# Altium schematic sheet gsm2.SchDoc
size A4
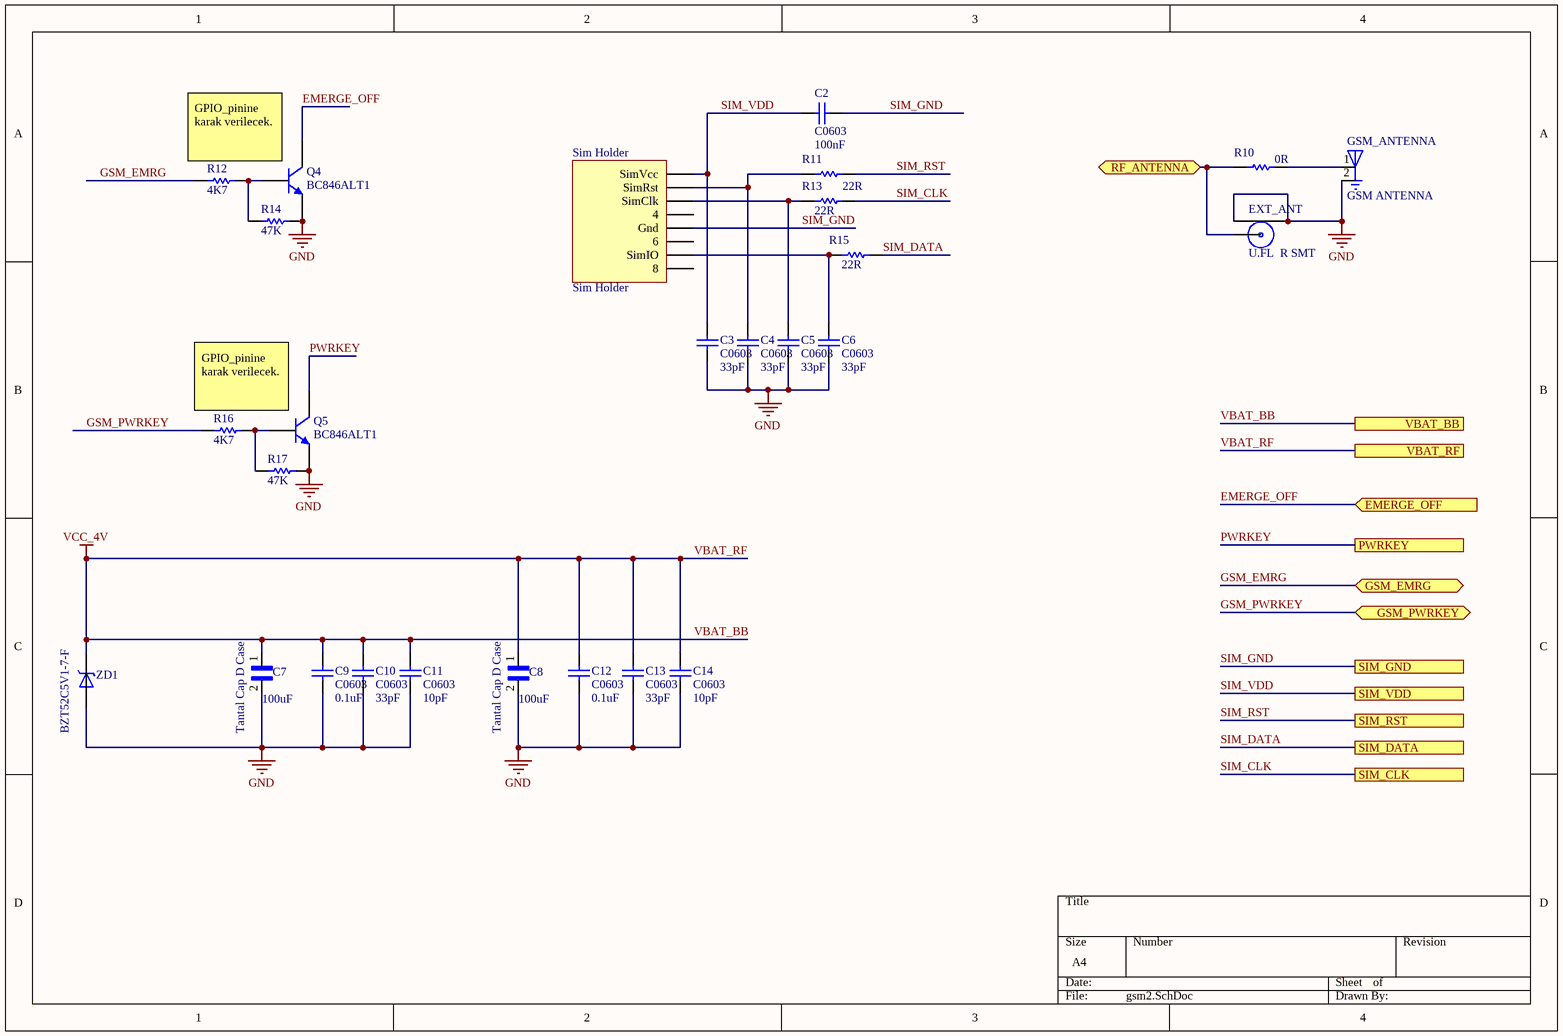
[diagram p0: gsm2.SchDoc]

## Parts
C2  C0603  value 100nF  [C0603]
C3  C0603  value 33pF  [C0603]
C4  C0603  value 33pF  [C0603]
C5  C0603  value 33pF  [C0603]
C6  C0603  value 33pF  [C0603]
C7  Tantal Cap D Case  value 100uF  [Tantal Cap D Case]
C8  Tantal Cap D Case  value 100uF  [Tantal Cap D Case]
C9  C0603  value 0.1uF  [C0603]
C10  C0603  value 33pF  [C0603]
C11  C0603  value 10pF  [C0603]
C12  C0603  value 0.1uF  [C0603]
C13  C0603  value 33pF  [C0603]
C14  C0603  value 10pF  [C0603]
EXT_ANT  U.FL  R SMT  [U.FL  R SMT]
GSM_ANTENNA  GSM ANTENNA  [GSM ANTENNA]
Q4  BC846ALT1  [BC846]
Q5  BC846ALT1  [BC846]
R10  value 0R  [CC1608-0603]  (hidden comment: Res0603)
R11  value 22R  [CC1608-0603]  (hidden comment: Res0603)
R12  value 4K7  [CC1608-0603]  (hidden comment: Res0603)
R13  value 22R  [CC1608-0603]  (hidden comment: Res0603)
R14  value 47K  [CC1608-0603]  (hidden comment: Res0603)
R15  value 22R  [CC1608-0603]  (hidden comment: Res0603)
R16  value 4K7  [CC1608-0603]  (hidden comment: Res0603)
R17  value 47K  [CC1608-0603]  (hidden comment: Res0603)
Sim_Holder  Sim Holder  [SIM HOLDER]
ZD1  BZT52C5V1-7-F  [BZT52C5V1]

## Ports
EMERGE_OFF (in), GSM_EMRG (bidir), GSM_PWRKEY (bidir), PWRKEY, RF_ANTENNA (bidir), SIM_CLK, SIM_DATA, SIM_GND, SIM_RST, SIM_VDD, VBAT_BB, VBAT_RF

## Nets
GND: C3.1 C4.1 C5.1 C6.1 C7.2 C8.2 C9.1 C10.1 C11.1 C12.1 C13.1 C14.1 EXT_ANT.P$2 EXT_ANT.P$3 GSM_ANTENNA.2(GND) Q4.2(E) Q5.2(E) R14.2 R17.2 ZD1.A
VBAT_BB: C7.1 C8.1 C9.2 C10.2 C11.2 C12.2 C13.2 C14.2 ZD1.C ; port VBAT_BB, port VBAT_RF  [also labelled VBAT_RF, VCC_4V]
EMERGE_OFF: Q4.3(C) ; port EMERGE_OFF
GSM_EMRG: R12.1 ; port GSM_EMRG
GSM_PWRKEY: R16.1 ; port GSM_PWRKEY
PWRKEY: Q5.3(C) ; port PWRKEY
RF_ANTENNA: EXT_ANT.P$1 R10.1 ; port RF_ANTENNA
SIM_CLK: R13.2 ; port SIM_CLK
SIM_DATA: R15.2 ; port SIM_DATA
SIM_GND: C2.2 Sim_Holder.5(Gnd) ; port SIM_GND
SIM_RST: R11.2 ; port SIM_RST
SIM_VDD: C2.1 C3.2 Sim_Holder.1(SimVcc) ; port SIM_VDD
NetC4_2: C4.2 R11.1 Sim_Holder.2(SimRst)
NetC5_2: C5.2 R13.1 Sim_Holder.3(SimClk)
NetC6_2: C6.2 R15.1 Sim_Holder.7(SimIO)
NetGSM_ANTENNA_1: GSM_ANTENNA.1(FEEDING) R10.2
NetQ4_1: Q4.1(B) R12.2 R14.1
NetQ5_1: Q5.1(B) R16.2 R17.1

Not connected (* = marked no-connect by the designer): Sim_Holder 4 6 8

## Notes on the sheet
- (near Q4) GPIO_pinine karak verilecek.
- (near Q5) GPIO_pinine karak verilecek.

## Library data of the parts
C2-C6 C9-C14 = C0603: Ceramic Chip Capacitor - Standard; Note: Footprint corresponds to dimensions for bulk cassette packaging. This case size has tightened tolerances.; Published: 17-Jul-2002; LatestRevisionDate: 19-Mar-2004; LatestRevisionNote: Silkscreen size reduced.; DatasheetDocument: Mar-2001; PackageDocument: Mar-2001; PackageReference: 0603; Publisher: Altium Limited; Code_JEITA: 0603; Code_IPC: 1608 [0603]; ComponentLink1Description: Manufacturer Link; ComponentLink1URL: http://www.kemet.com/; ComponentLink2Description: Datasheet; ComponentLink2URL: http://www.kemet.com/kemet/web/homepage/kechome.nsf/vapubfilesname/F3102TA.pdf/$file/F3102TA.pdf
Q4 Q5 = BC846ALT1: General Purpose Transistor NPN Silicon; Published: 29-Sep-2000; LatestRevisionDate: 17-Jul-2002; LatestRevisionNote: Re-released for DXP Platform.; DatasheetVersion: 1997; PackageVersion: 1997; PackageReference: 318-08; Publisher: Altium Limited; PackageDescription: SOT-23; 3 Leads; Body 3.0 x 2.6 mm, inc. leads (LxW max); ComponentLink1Description: Manufacturer Link; ComponentLink1URL: http://www.onsemi.com/site/products/landing?taxonomyID=194; ComponentLink2Description: Datasheet; ComponentLink2URL: http://www.onsemi.com/pub/Collateral/BC846ALT1-D.PDF
R10-R17 = Res0603: Resistor; Manufacturer: Generic Components; Class I: Passive; Published: 8-Jun-2000; Revision: July-2002: Re-released for DXP Platform.; Publisher: Altium Limited; Class II: Resistor